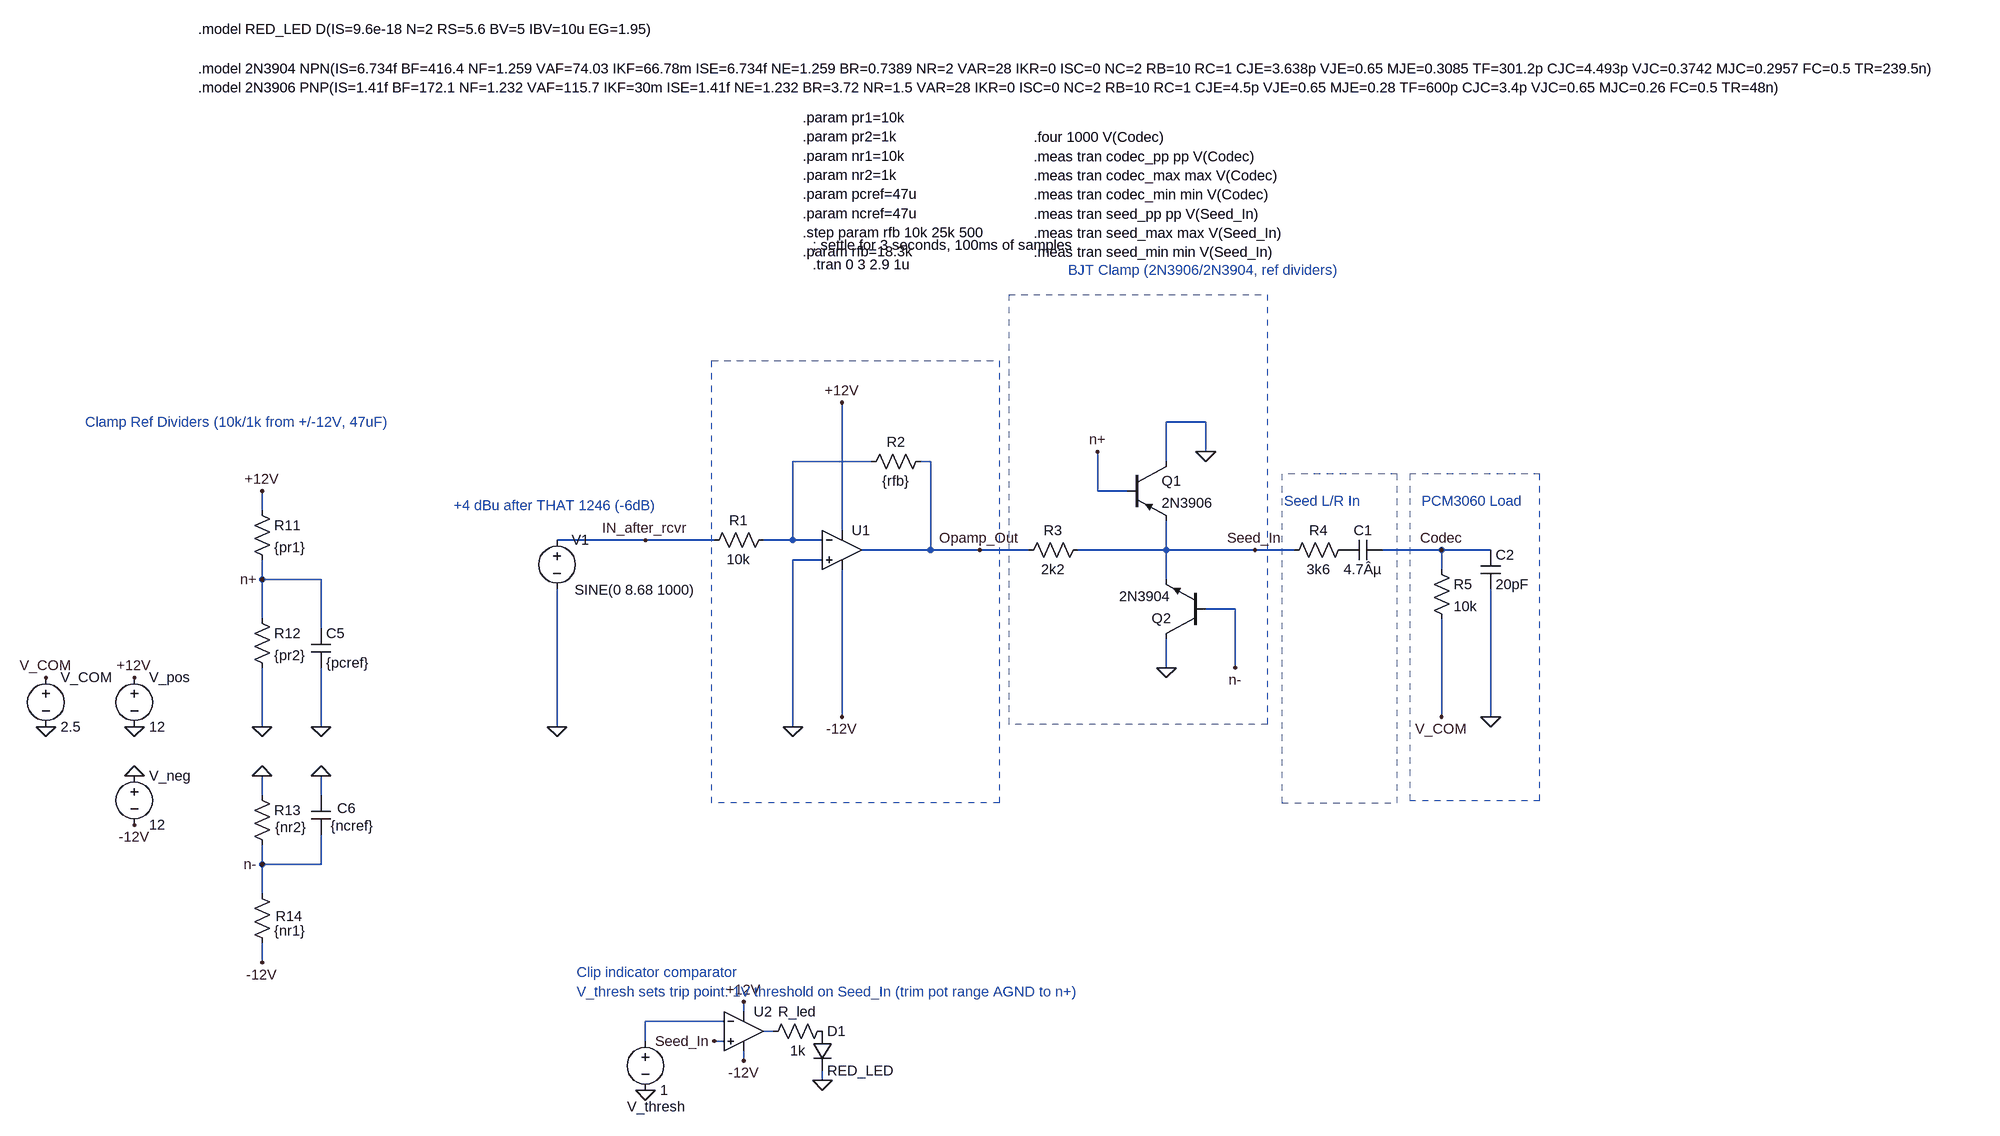
[diagram p0: schematic sharper-diode.asc]
sharper-diode.asc, the LTspice schematic file:
Version 4
SHEET 1 3124 2460
WIRE 1152 512 1088 512
WIRE 1152 560 1152 512
WIRE 608 576 480 576
WIRE 704 576 688 576
WIRE 1088 576 1088 512
WIRE 976 624 976 560
WIRE 1024 624 976 624
WIRE -384 656 -384 624
WIRE 560 688 560 480
WIRE 240 704 96 704
WIRE 352 704 240 704
WIRE 480 704 480 576
WIRE 480 704 432 704
WIRE 528 704 480 704
WIRE 704 720 704 576
WIRE 704 720 592 720
WIRE 784 720 704 720
WIRE 864 720 784 720
WIRE 1088 720 1088 672
WIRE 1088 720 944 720
WIRE 1232 720 1088 720
WIRE 1296 720 1232 720
WIRE 1536 720 1440 720
WIRE 1616 720 1536 720
WIRE 528 736 480 736
WIRE 1536 752 1536 720
WIRE -384 768 -384 736
WIRE -288 768 -384 768
WIRE 1088 768 1088 720
WIRE 1200 816 1152 816
WIRE -384 832 -384 768
WIRE -288 848 -288 768
WIRE 1088 912 1088 864
WIRE 1200 912 1200 816
WIRE 560 992 560 752
WIRE 1536 992 1536 832
WIRE 1616 992 1616 784
WIRE -384 1008 -384 912
WIRE -288 1008 -288 912
WIRE 96 1008 96 784
WIRE 480 1008 480 736
WIRE -384 1120 -384 1088
WIRE -288 1120 -288 1088
WIRE -384 1232 -384 1200
WIRE -288 1232 -288 1184
WIRE -288 1232 -384 1232
WIRE -384 1280 -384 1232
WIRE -384 1392 -384 1360
WIRE 400 1472 400 1456
WIRE 368 1488 240 1488
WIRE 448 1504 432 1504
WIRE 240 1520 240 1488
WIRE 368 1520 352 1520
WIRE 400 1552 400 1536
WIRE 528 1584 528 1568
FLAG -592 928 +12V
FLAG -592 1008 0
FLAG -592 1088 0
FLAG -592 1168 -12V
FLAG -384 624 +12V
FLAG -384 768 n+
FLAG -384 1008 0
FLAG -288 1008 0
FLAG -384 1088 0
FLAG -384 1232 n-
FLAG -384 1392 -12V
FLAG -288 1088 0
FLAG -736 928 V_COM
FLAG -736 1008 0
FLAG 96 1008 0
FLAG 240 704 IN_after_rcvr
FLAG 480 1008 0
FLAG 560 480 +12V
FLAG 560 992 -12V
FLAG 784 720 Opamp_Out
FLAG 1232 720 Seed_In
FLAG 1536 720 Codec
FLAG 1536 992 V_COM
FLAG 1616 992 0
FLAG 976 560 n+
FLAG 1152 560 0
FLAG 1200 912 n-
FLAG 1088 912 0
FLAG 352 1520 Seed_In
FLAG 240 1600 0
FLAG 400 1456 +12V
FLAG 400 1552 -12V
FLAG 528 1584 0
SYMBOL voltage -592 912 R0
SYMATTR InstName V_pos
SYMATTR Value 12
SYMBOL voltage -592 1072 R0
SYMATTR InstName V_neg
SYMATTR Value 12
SYMBOL res -400 640 R0
SYMATTR InstName R11
SYMATTR Value {pr1}
SYMBOL res -400 816 R0
SYMATTR InstName R12
SYMATTR Value {pr2}
SYMBOL cap -304 848 R0
SYMATTR InstName C5
SYMATTR Value {pcref}
SYMBOL res -400 1104 R0
WINDOW 3 37 68 Left 2
SYMATTR Value {nr2}
SYMATTR InstName R13
SYMBOL res -400 1264 R0
WINDOW 0 38 53 Left 2
SYMATTR InstName R14
SYMATTR Value {nr1}
SYMBOL cap -304 1120 R0
WINDOW 0 42 21 Left 2
WINDOW 3 32 49 Left 2
SYMATTR InstName C6
SYMATTR Value {ncref}
SYMBOL voltage -736 912 R0
SYMATTR InstName V_COM
SYMATTR Value 2.5
SYMBOL voltage 96 688 R0
WINDOW 3 29 97 Left 2
SYMATTR Value SINE(0 8.68 1000)
SYMATTR InstName V1
SYMATTR Value2 AC 1
SYMBOL res 336 720 R270
WINDOW 0 32 56 VTop 2
WINDOW 3 0 56 VBottom 2
SYMATTR InstName R1
SYMATTR Value 10k
SYMBOL OpAmps/UniversalOpAmp2 560 720 R0
SYMATTR InstName U1
SYMATTR Value2 Avol=1Meg GBW=53Meg Slew=24Meg
SYMBOL res 592 592 R270
WINDOW 0 32 56 VTop 2
WINDOW 3 0 56 VBottom 2
SYMATTR InstName R2
SYMATTR Value {rfb}
SYMBOL res 848 736 R270
WINDOW 0 32 56 VTop 2
WINDOW 3 0 56 VBottom 2
SYMATTR InstName R3
SYMATTR Value 2k2
SYMBOL pnp 1024 576 R0
SYMATTR InstName Q1
SYMATTR Value 2N3906
SYMBOL npn 1152 864 R180
SYMATTR InstName Q2
SYMATTR Value 2N3904
SYMBOL res 1280 736 R270
WINDOW 0 32 56 VTop 2
WINDOW 3 0 56 VBottom 2
SYMATTR InstName R4
SYMATTR Value 3k6
SYMBOL cap 1440 704 R90
WINDOW 0 0 32 VBottom 2
WINDOW 3 32 32 VTop 2
SYMATTR InstName C1
SYMATTR Value 4.7Âµ
SYMBOL res 1520 736 R0
SYMATTR InstName R5
SYMATTR Value 10k
SYMBOL cap 1600 720 R0
SYMATTR InstName C2
SYMATTR Value 20pF
SYMBOL OpAmps/UniversalOpAmp2 400 1504 R0
SYMATTR InstName U2
SYMBOL voltage 240 1504 R0
WINDOW 0 -30 123 Left 2
SYMATTR InstName V_thresh
SYMATTR Value 1
SYMBOL res 432 1520 R270
WINDOW 0 32 56 VTop 2
WINDOW 3 0 56 VBottom 2
SYMATTR InstName R_led
SYMATTR Value 1k
SYMBOL diode 512 1504 R0
SYMATTR InstName D1
SYMATTR Value RED_LED
TEXT 512 224 Left 2 !; settle for 3 seconds, 100ms of samples\n.tran 0 3 2.9 1u
TEXT -488 -64 Left 2 !.model 2N3904 NPN(IS=6.734f BF=416.4 NF=1.259 VAF=74.03 IKF=66.78m ISE=6.734f NE=1.259 BR=0.7389 NR=2 VAR=28 IKR=0 ISC=0 NC=2 RB=10 RC=1 CJE=3.638p VJE=0.65 MJE=0.3085 TF=301.2p CJC=4.493p VJC=0.3742 MJC=0.2957 FC=0.5 TR=239.5n)\n.model 2N3906 PNP(IS=1.41f BF=172.1 NF=1.232 VAF=115.7 IKF=30m ISE=1.41f NE=1.232 BR=3.72 NR=1.5 VAR=28 IKR=0 ISC=0 NC=2 RB=10 RC=1 CJE=4.5p VJE=0.65 MJE=0.28 TF=600p CJC=3.4p VJC=0.65 MJC=0.26 FC=0.5 TR=48n)
TEXT -488 -128 Left 2 !.model RED_LED D(IS=9.6e-18 N=2 RS=5.6 BV=5 IBV=10u EG=1.95)
TEXT -72 648 Left 2 ;+4 dBu after THAT 1246 (-6dB)
TEXT 928 264 Left 2 ;BJT Clamp (2N3906/2N3904, ref dividers)
TEXT 1280 640 Left 2 ;Seed L/R In
TEXT 1504 640 Left 2 ;PCM3060 Load
TEXT -672 512 Left 2 ;Clamp Ref Dividers (10k/1k from +/-12V, 47uF)
TEXT 496 16 Left 2 !.param pr1=10k\n.param pr2=1k\n.param nr1=10k\n.param nr2=1k\n.param pcref=47u\n.param ncref=47u\n.step param rfb 10k 25k 500\n.param rfb=18.3k
TEXT 872 48 Left 2 !.four 1000 V(Codec)\n.meas tran codec_pp pp V(Codec)\n.meas tran codec_max max V(Codec)\n.meas tran codec_min min V(Codec)\n.meas tran seed_pp pp V(Seed_In)\n.meas tran seed_max max V(Seed_In)\n.meas tran seed_min min V(Seed_In)
TEXT 128 1408 Left 2 ;Clip indicator comparator
TEXT 128 1440 Left 2 ;V_thresh sets trip point: 1V threshold on Seed_In (trim pot range AGND to n+)
RECTANGLE Normal 1484 1128 1696 596 2
RECTANGLE Normal 1276 1132 1464 596 2
RECTANGLE Normal 1252 1004 832 304 2
RECTANGLE Normal 816 1132 348 412 2

The netlist it stands for:
* sharper-diode.asc
V_pos +12V 0 12
V_neg 0 -12V 12
R11 +12V n+ {pr1}
R12 n+ 0 {pr2}
C5 n+ 0 {pcref}
R13 0 n- {nr2}
R14 n- -12V {nr1}
C6 0 n- {ncref}
V_COM V_COM 0 2.5
V1 IN_after_rcvr 0 SINE(0 8.68 1000) AC 1
R1 IN_after_rcvr N001 10k
XU1 0 N001 +12V -12V Opamp_Out level2 Avol=1Meg GBW=53Meg Slew=24Meg Ilimit=25m Rail=0 Vos=0 En=0 Enk=0 In=0 Ink=0 Rin=500Meg  ; pins In+ In- V+ V- OUT
R2 N001 Opamp_Out {rfb}
R3 Opamp_Out Seed_In 2k2
Q1 0 n+ Seed_In 0 2N3906
Q2 0 n- Seed_In 0 2N3904
R4 Seed_In P001 3k6
C1 Codec P001 4.7Âµ
R5 Codec V_COM 10k
C2 Codec 0 20pF
XU2 Seed_In N002 +12V -12V N003 level2 Avol=1Meg GBW=10Meg Slew=10Meg Ilimit=25m Rail=0 Vos=0 En=0 Enk=0 In=0 Ink=0 Rin=500Meg  ; pins In+ In- V+ V- OUT
V_thresh N002 0 1
R_led N003 P002 1k
D1 P002 0 RED_LED
.model D D
.lib standard.dio
.model NPN NPN
.model PNP PNP
.lib standard.bjt
; settle for 3 seconds, 100ms of samples
.tran 0 3 2.9 1u
.model 2N3904 NPN(IS=6.734f BF=416.4 NF=1.259 VAF=74.03 IKF=66.78m ISE=6.734f NE=1.259 BR=0.7389 NR=2 VAR=28 IKR=0 ISC=0 NC=2 RB=10 RC=1 CJE=3.638p VJE=0.65 MJE=0.3085 TF=301.2p CJC=4.493p VJC=0.3742 MJC=0.2957 FC=0.5 TR=239.5n)
.model 2N3906 PNP(IS=1.41f BF=172.1 NF=1.232 VAF=115.7 IKF=30m ISE=1.41f NE=1.232 BR=3.72 NR=1.5 VAR=28 IKR=0 ISC=0 NC=2 RB=10 RC=1 CJE=4.5p VJE=0.65 MJE=0.28 TF=600p CJC=3.4p VJC=0.65 MJC=0.26 FC=0.5 TR=48n)
.model RED_LED D(IS=9.6e-18 N=2 RS=5.6 BV=5 IBV=10u EG=1.95)
* +4 dBu after THAT 1246 (-6dB)
* BJT Clamp (2N3906/2N3904, ref dividers)
* Seed L/R In
* PCM3060 Load
* Clamp Ref Dividers (10k/1k from +/-12V, 47uF)
.param pr1=10k
.param pr2=1k
.param nr1=10k
.param nr2=1k
.param pcref=47u
.param ncref=47u
.step param rfb 10k 25k 500
.param rfb=18.3k
.four 1000 V(Codec)
.meas tran codec_pp pp V(Codec)
.meas tran codec_max max V(Codec)
.meas tran codec_min min V(Codec)
.meas tran seed_pp pp V(Seed_In)
.meas tran seed_max max V(Seed_In)
.meas tran seed_min min V(Seed_In)
* Clip indicator comparator
* V_thresh sets trip point: 1V threshold on Seed_In (trim pot range AGND to n+)
.lib UniversalOpAmp2.lib
.backanno
.end